# Altium schematic sheet LM2596-4.SchDoc
size A4
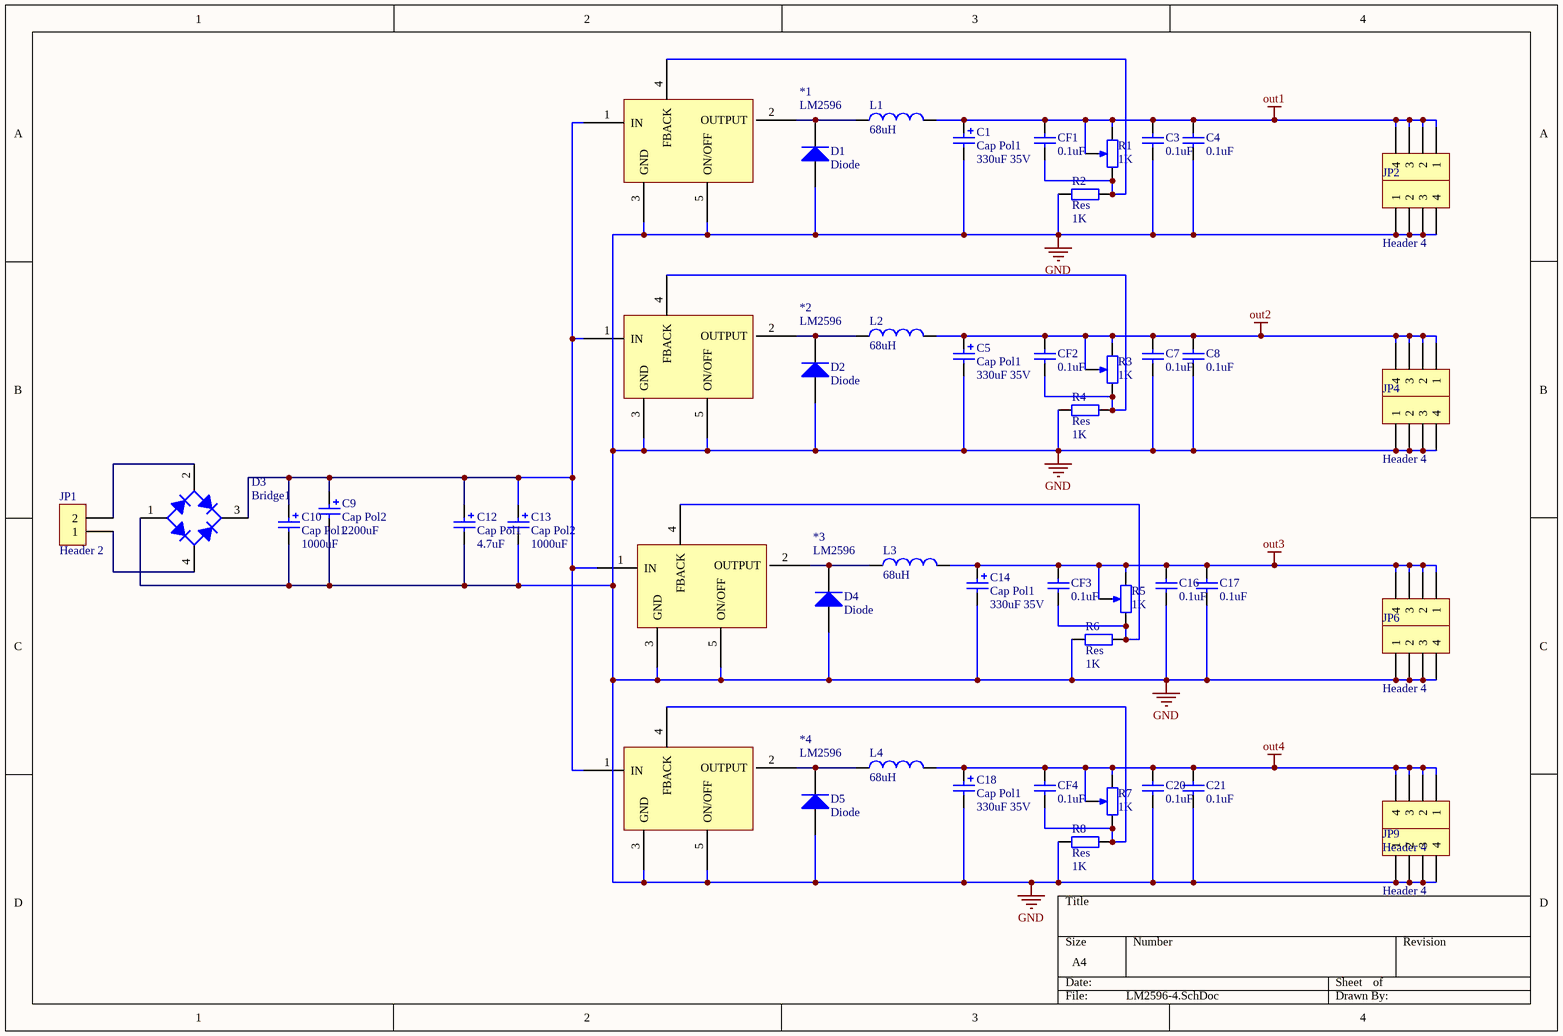
[diagram p0: LM2596-4.SchDoc]

## Parts
*1  LM2596  [HDR1-5]
*2  LM2596  [HDR1-5]
*3  LM2596  [HDR1-5]
*4  LM2596  [HDR1-5]
C1  Cap Pol1  value 330uF 35V  [RB0.3-0.65]
C3  value 0.1uF  [CC1005-0402]  (hidden comment: CAP)
C4  value 0.1uF  [CC1005-0402]  (hidden comment: CAP)
C5  Cap Pol1  value 330uF 35V  [RB0.3-0.65]
C7  value 0.1uF  [CC1005-0402]  (hidden comment: CAP)
C8  value 0.1uF  [CC1005-0402]  (hidden comment: CAP)
C9  Cap Pol2  value 2200uF  [RB0.3-0.65]
C10  Cap Pol1  value 1000uF  [RB0.3-0.65]
C12  Cap Pol1  value 4.7uF  [R-0805]
C13  Cap Pol2  value 1000uF  [RB0.2-0.50]
C14  Cap Pol1  value 330uF 35V  [RB0.3-0.65]
C16  value 0.1uF  [CC1005-0402]  (hidden comment: CAP)
C17  value 0.1uF  [CC1005-0402]  (hidden comment: CAP)
C18  Cap Pol1  value 330uF 35V  [RB0.3-0.65]
C20  value 0.1uF  [CC1005-0402]  (hidden comment: CAP)
C21  value 0.1uF  [CC1005-0402]  (hidden comment: CAP)
CF1  value 0.1uF  [CC1005-0402]  (hidden comment: CAP)
CF2  value 0.1uF  [CC1005-0402]  (hidden comment: CAP)
CF3  value 0.1uF  [CC1005-0402]  (hidden comment: CAP)
CF4  value 0.1uF  [CC1005-0402]  (hidden comment: CAP)
D1  Diode  [Diode-5817]
D2  Diode  [Diode-5817]
D3  Bridge1  [qiao]
D4  Diode  [Diode-5817]
D5  Diode  [Diode-5817]
JP1  Header 2  [H-2/2]
JP2  Header 4  [HDR1-4]
JP3  Header 4  [HDR1-4]
JP4  Header 4  [HDR1-4]
JP5  Header 4  [HDR1-4]
JP6  Header 4  [HDR1-4]
JP7  Header 4  [HDR1-4]
JP8  Header 4  [HDR1-4]
JP9  Header 4  [HDR1-4]
L1  value 68uH  [RBL0.2]  (hidden comment: INDUCTOT)
L2  value 68uH  [RBL0.2]  (hidden comment: INDUCTOT)
L3  value 68uH  [RBL0.2]  (hidden comment: INDUCTOT)
L4  value 68uH  [RBL0.2]  (hidden comment: INDUCTOT)
R1  value 1K  [VR-S]  (hidden comment: RES-Pot2)
R2  Res  value 1K  [1n4148]
R3  value 1K  [VR-S]  (hidden comment: RES-Pot2)
R4  Res  value 1K  [1n4148]
R5  value 1K  [VR-S]  (hidden comment: RES-Pot2)
R6  Res  value 1K  [1n4148]
R7  value 1K  [VR-S]  (hidden comment: RES-Pot2)
R8  Res  value 1K  [1n4148]

## Nets
GND: *1.3(GND) *1.5(ON/OFF) *2.3(GND) *2.5(ON/OFF) *3.3(GND) *3.5(ON/OFF) *4.3(GND) *4.5(ON/OFF) C1.2 C3.1 C4.1 C5.2 C7.1 C8.1 C9.2 C10.2 C12.2 C13.2 C14.2 C16.1 C17.1 C18.2 C20.1 C21.1 D1.1(A) D2.1(A) D3.1(A) D4.1(A) D5.1(A) JP2.1 JP2.2 JP2.3 JP2.4 JP4.1 JP4.2 JP4.3 JP4.4 JP6.1 JP6.2 JP6.3 JP6.4 JP8.1 JP8.2 JP8.3 JP8.4 R2.2 R4.2 R6.2 R8.2
out1: C1.1 C3.2 C4.2 CF1.2 JP3.1 JP3.2 JP3.3 JP3.4 L1.2 R1.2(TAP) R1.3(TOP)
out2: C5.1 C7.2 C8.2 CF2.2 JP5.1 JP5.2 JP5.3 JP5.4 L2.2 R3.2(TAP) R3.3(TOP)
out3: C14.1 C16.2 C17.2 CF3.2 JP7.1 JP7.2 JP7.3 JP7.4 L3.2 R5.2(TAP) R5.3(TOP)
out4: C18.1 C20.2 C21.2 CF4.2 JP9.1 JP9.2 JP9.3 JP9.4 L4.2 R7.2(TAP) R7.3(TOP)
Net*1_1: *1.1(IN) *2.1(IN) *3.1(IN) *4.1(IN) C9.1 C10.1 C12.1 C13.1 D3.3(K)
Net*1_2: *1.2(OUTPUT) D1.2(K) L1.1
Net*1_4: *1.4(FBACK) CF1.1 R1.1(BOT) R2.1
Net*2_2: *2.2(OUTPUT) D2.2(K) L2.1
Net*2_4: *2.4(FBACK) CF2.1 R3.1(BOT) R4.1
Net*3_2: *3.2(OUTPUT) D4.2(K) L3.1
Net*3_4: *3.4(FBACK) CF3.1 R5.1(BOT) R6.1
Net*4_2: *4.2(OUTPUT) D5.2(K) L4.1
Net*4_4: *4.4(FBACK) CF4.1 R7.1(BOT) R8.1
NetD3_2: D3.2(C) JP1.2
NetD3_4: D3.4(C) JP1.1

## Library data of the parts
C1 C5 C10 C12 C14 C18 = Cap Pol1: Polarized Capacitor (Radial); Manufacturer: Generic Components; Class: Passive; Published: 08/06/2000; Publisher: Altium Hobart Technology Centre; SubClass: Capacitor
C3 C4 C7 C8 C16 C17 C20 C21 CF1-CF4 = CAP: Capacitor; Manufacturer: Generic Components; Class: Passive; Published: 08/06/2000; Publisher: Altium Hobart Technology Centre; SubClass: Capacitor
C9 C13 = Cap Pol2: Polarized Capacitor (Axial); Manufacturer: Generic Components; Class: Passive; Published: 08/06/2000; Publisher: Altium Hobart Technology Centre; SubClass: Capacitor
D1 D2 D4 D5 = Diode: Default Diode; Manufacturer: Generic Components; Class: Discrete; SubClass: Diode - Switching; Published: 08/06/2000; Publisher: Altium Hobart Technology Centre
D3 = Bridge1: Full Wave Diode Bridge; Manufacturer: Generic Components; Class: Discrete; SubClass: Rectifier - Bridge; Published: 08/06/2000; Publisher: Altium Hobart Technology Centre
JP1 = Header 2: Header, 2-Pin; Manufacturer: Generic Components; Class: Connector
JP2-JP9 = Header 4: Header, 4-Pin; Manufacturer: Generic Components; Class: Connector
L1-L4 = INDUCTOT: Inductor; Manufacturer: Generic Components; Class: Passive; Published: 08/06/2000; Publisher: Altium Hobart Technology Centre; SubClass: Inductor
R1 R3 R5 R7 = RES-Pot2: Potentiometer; Class: Passive; SubClass: Potentiometer
R2 R4 R6 R8 = Res: Resistor; Manufacturer: Generic Components; Class: Passive; Published: 08/06/2000; Publisher: Altium Hobart Technology Centre; SubClass: Resistor